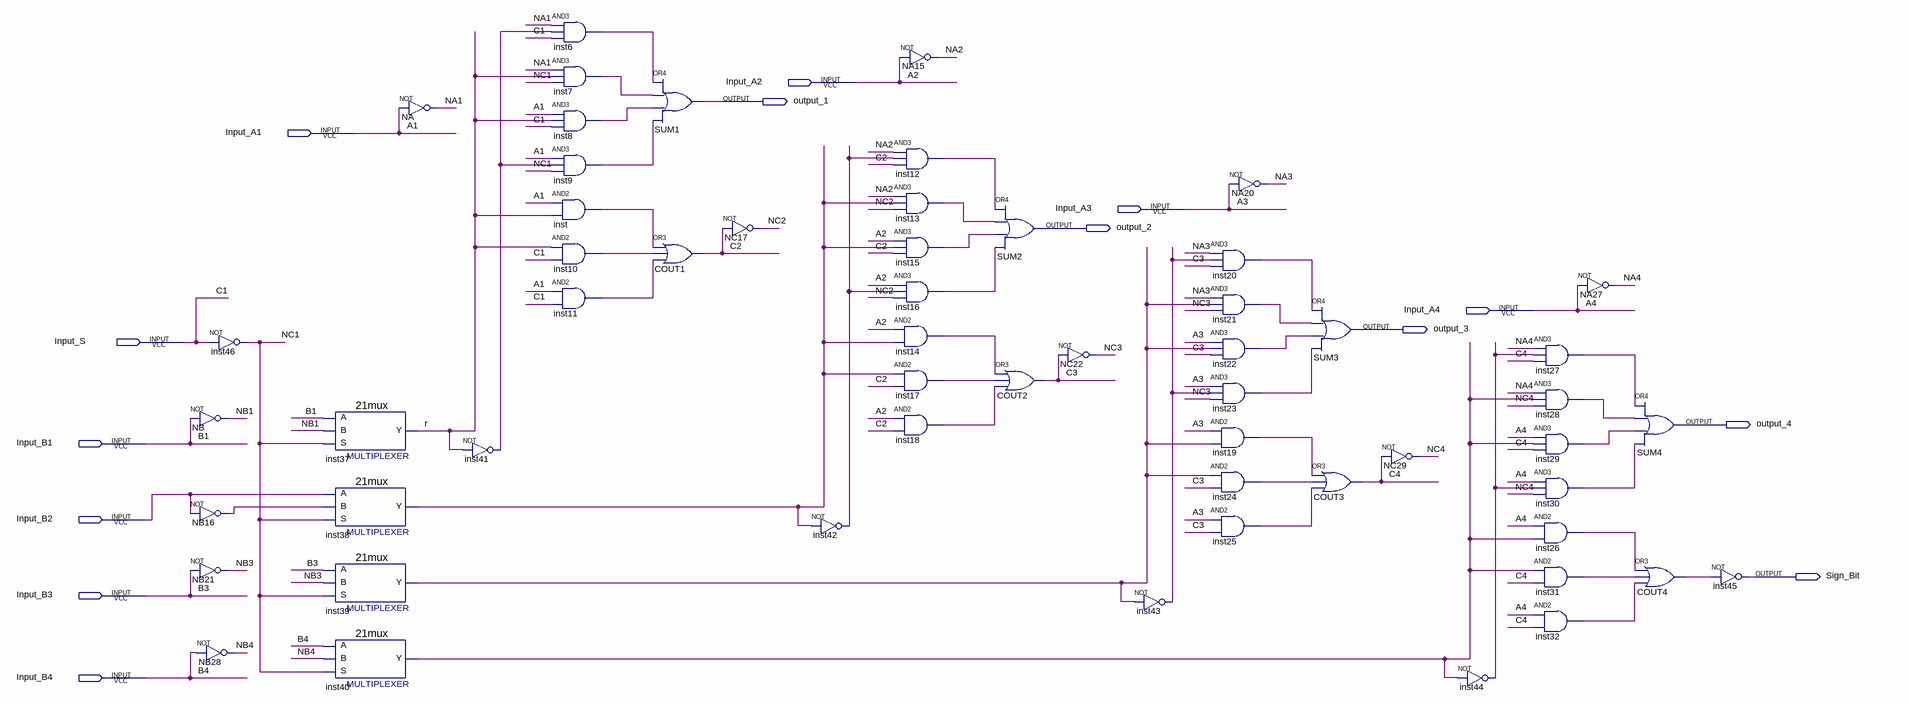
[diagram p0: schematic sheet]
// Quartus schematic AdderSubtracter.bdf as structural Verilog: 57 symbols, 14 pins
module AdderSubtracter (
  input  Input_A2,
  input  Input_A1,
  input  Input_A3,
  input  Input_A4,
  input  Input_S,
  input  Input_B1,
  input  Input_B2,
  input  Input_B3,
  input  Input_B4,
  output output_1,
  output output_2,
  output output_3,
  output output_4,
  output Sign_Bit
);

  wire C2, C3, C4, COUT4_out, inst6_out, inst7_out, inst8_out, inst9_out, inst10_out, inst11_out, inst12_out,
       inst13_out, inst14_out, inst15_out, inst16_out, inst17_out, inst18_out, inst19_out, inst20_out,
       inst21_out, inst22_out, inst23_out, inst24_out, inst25_out, inst26_out, inst27_out, inst28_out,
       inst29_out, inst30_out, inst31_out, inst32_out, inst38_y, inst39_y, inst40_y, inst41_out, inst42_out,
       inst43_out, inst44_out, inst_out, NA1, NA2, NA3, NA4, NB1, NB3, NB4, NB16_out, NC1, NC2, NC3, NC4, r;

  not inst46 (NC1, Input_S);
  not NB (NB1, Input_B1);
  not NB16 (NB16_out, Input_B2);
  not NB21 (NB3, Input_B3);
  not NB28 (NB4, Input_B4);
  \21mux  inst37 (.S(NC1), .B(NB1), .A(Input_B1), .Y(r));
  \21mux  inst38 (.S(NC1), .B(NB16_out), .A(Input_B2), .Y(inst38_y));
  \21mux  inst39 (.S(NC1), .B(NB3), .A(Input_B3), .Y(inst39_y));
  \21mux  inst40 (.S(NC1), .B(NB4), .A(Input_B4), .Y(inst40_y));
  not NA (NA1, Input_A1);
  not inst41 (inst41_out, r);
  and inst6 (inst6_out, NA1, inst41_out, Input_S);
  and inst7 (inst7_out, NA1, r, NC1);
  and inst8 (inst8_out, Input_A1, r, Input_S);
  and inst9 (inst9_out, Input_A1, inst41_out, NC1);
  and inst (inst_out, Input_A1, r);
  and inst10 (inst10_out, r, Input_S);
  and inst11 (inst11_out, Input_A1, Input_S);
  or SUM1 (output_1, inst6_out, inst7_out, inst8_out, inst9_out);
  or COUT1 (C2, inst_out, inst10_out, inst11_out);
  not NC17 (NC2, C2);
  not inst42 (inst42_out, inst38_y);
  not NA15 (NA2, Input_A2);
  and inst12 (inst12_out, NA2, inst42_out, C2);
  and inst13 (inst13_out, NA2, inst38_y, NC2);
  and inst15 (inst15_out, Input_A2, inst38_y, C2);
  and inst16 (inst16_out, Input_A2, inst42_out, NC2);
  and inst14 (inst14_out, Input_A2, inst38_y);
  and inst17 (inst17_out, inst38_y, C2);
  and inst18 (inst18_out, Input_A2, C2);
  or SUM2 (output_2, inst12_out, inst13_out, inst15_out, inst16_out);
  or COUT2 (C3, inst14_out, inst17_out, inst18_out);
  not NC22 (NC3, C3);
  not inst43 (inst43_out, inst39_y);
  not NA20 (NA3, Input_A3);
  and inst20 (inst20_out, NA3, inst43_out, C3);
  and inst21 (inst21_out, NA3, inst39_y, NC3);
  and inst22 (inst22_out, Input_A3, inst39_y, C3);
  and inst23 (inst23_out, Input_A3, inst43_out, NC3);
  and inst19 (inst19_out, Input_A3, inst39_y);
  and inst24 (inst24_out, inst39_y, C3);
  and inst25 (inst25_out, Input_A3, C3);
  or SUM3 (output_3, inst20_out, inst21_out, inst22_out, inst23_out);
  or COUT3 (C4, inst19_out, inst24_out, inst25_out);
  not NC29 (NC4, C4);
  not inst44 (inst44_out, inst40_y);
  and inst27 (inst27_out, NA4, inst44_out, C4);
  and inst28 (inst28_out, NA4, inst40_y, NC4);
  and inst29 (inst29_out, Input_A4, inst40_y, C4);
  and inst30 (inst30_out, Input_A4, inst44_out, NC4);
  and inst26 (inst26_out, Input_A4, inst40_y);
  and inst31 (inst31_out, inst40_y, C4);
  and inst32 (inst32_out, Input_A4, C4);
  not NA27 (NA4, Input_A4);
  or SUM4 (output_4, inst27_out, inst28_out, inst29_out, inst30_out);
  or COUT4 (COUT4_out, inst26_out, inst31_out, inst32_out);
  not inst45 (Sign_Bit, COUT4_out);

  // Other names for the same wires on the sheet: A4 = Input_A4; B1 = Input_B1; B3 = Input_B3; B4 = Input_B4;
  //   A1 = Input_A1; A2 = Input_A2; A3 = Input_A3; C1 = Input_S
endmodule
